# EAGLE design minibat (EAGLE 9.6.2)
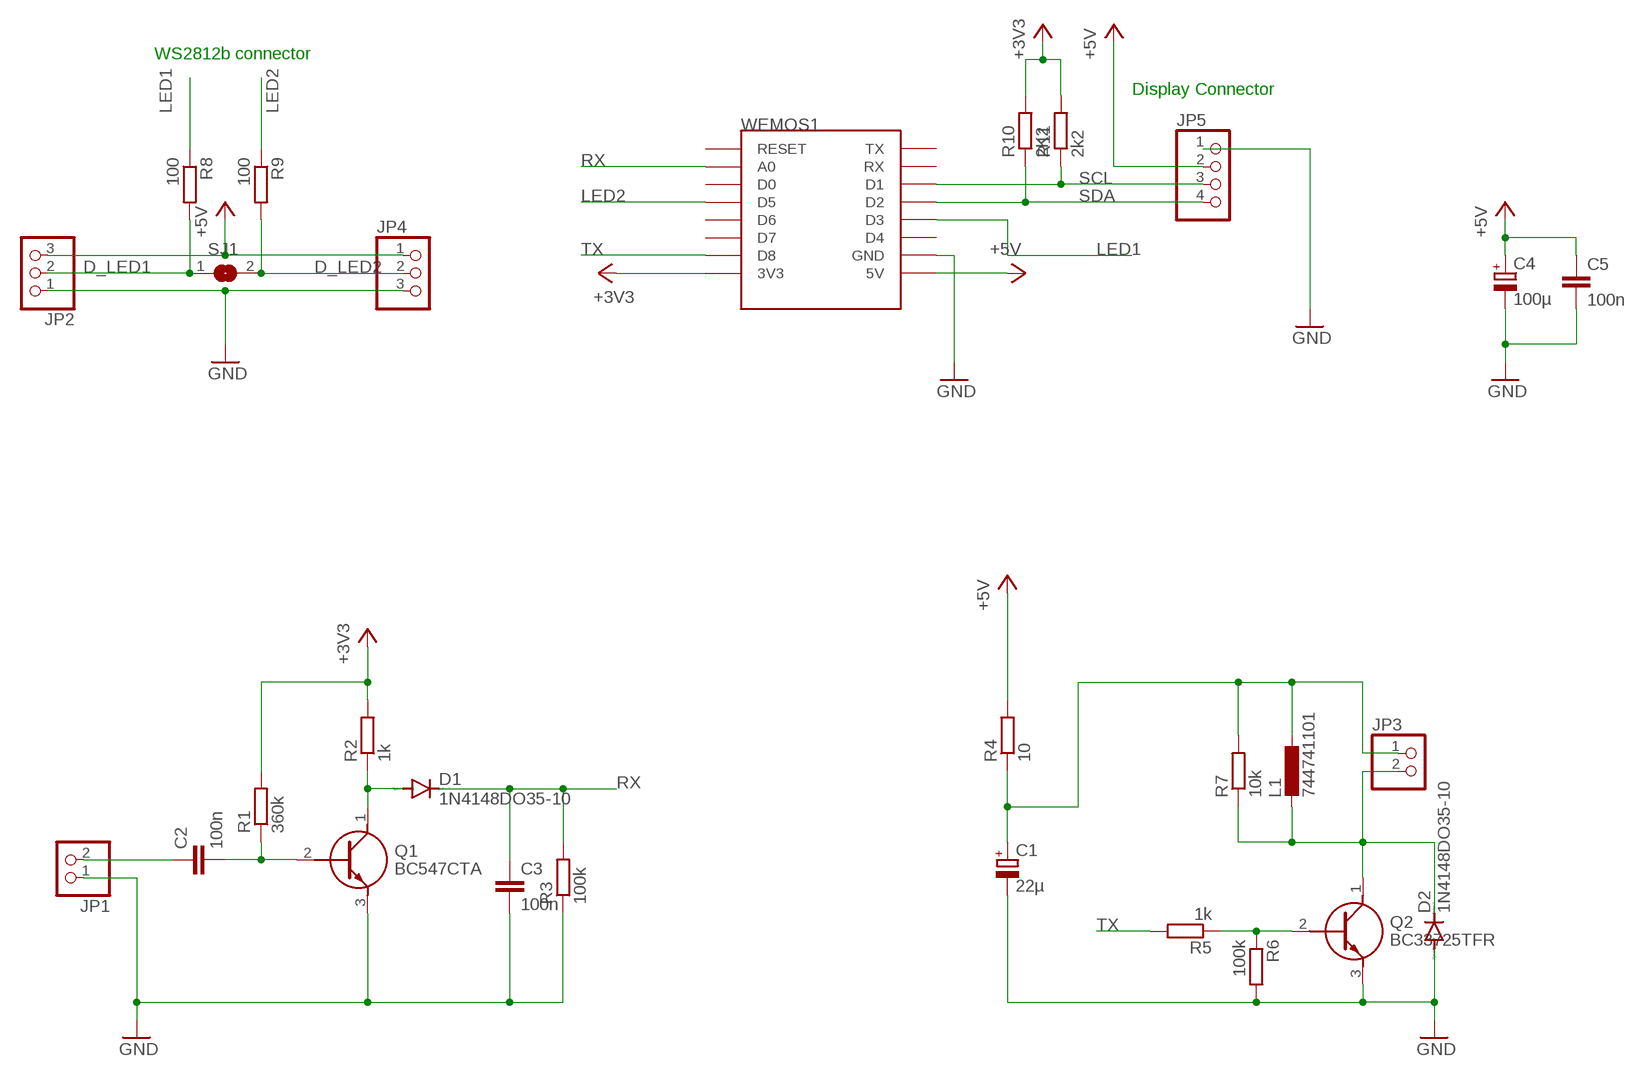
[diagram p0: schematic, sheet 1]

## Parts
C1  22µ  CPOL-EUE5-8.5  [E5-8,5]
C2  100n  C-EU050-035X075  [C050-035X075]
C3  100n  C-EU050-035X075  [C050-035X075]
C4  100µ  CPOL-EUE5-8.5  [E5-8,5]
C5  100n  C-EU050-035X075  [C050-035X075]
D1  1N4148DO35-10  [DO35-10]
D2  1N4148DO35-10  [DO35-10]
JP1  PINHD-1X2  [1X02]
JP2  PINHD-1X3  [1X03]
JP3  PINHD-1X2  [1X02]
JP4  PINHD-1X3  [1X03]
JP5  PINHD-1X4  [1X04]
L1  744741101  L-EU6000-XXX-RC  [6000-XXXX-RC]
Q1  BC547CTA  [MC79L15ACPG]
Q2  BC33725TFR  [BC33725TFR]
R1  360k  R-EU_0207/10  [0207/10]
R2  1k  R-EU_0207/10  [0207/10]
R3  100k  R-EU_0207/10  [0207/10]
R4  10  R-EU_0207/10  [0207/10]
R5  1k  R-EU_0207/10  [0207/10]
R6  100k  R-EU_0207/10  [0207/10]
R7  10k  R-EU_0207/10  [0207/10]
R8  100  R-EU_0207/10  [0207/10]
R9  100  R-EU_0207/10  [0207/10]
R10  2K2  R-EU_0207/10  [0207/10]
R11  2k2  R-EU_0207/10  [0207/10]
SJ1  SJ  [SJ]
WEMOS1  WEMOS-D1-MINI  [WEMOS-D1-MINI]

## Nets
+3V3: R1.2 R2.2 R10.2 R11.2 WEMOS1.3V3
+5V: C4.+ C5.1 JP2.3 JP4.1 JP5.2 R4.2 WEMOS1.5V
D_LED1: JP2.2 R8.2 SJ1.1
D_LED2: JP4.2 R9.2 SJ1.2
GND: C1.- C3.2 C4.- C5.2 D2.A JP1.1 JP2.1 JP4.3 JP5.1 Q1.3(E) Q2.3(E) R3.1 R6.2 WEMOS1.GND
LED1: R8.1 WEMOS1.D3
LED2: R9.1 WEMOS1.D5
N$1: C2.1 JP1.2
N$3: D1.A Q1.1(C) R2.1
N$4: C2.2 Q1.2(B) R1.1
N$5: C1.+ JP3.1 L1.1 R4.1 R7.2
N$7: D2.C JP3.2 L1.2 Q2.1(C) R7.1
N$9: Q2.2(B) R5.1 R6.1
RX: C3.1 D1.C R3.2 WEMOS1.A0
SCL: JP5.3 R11.1 WEMOS1.D1
SDA: JP5.4 R10.1 WEMOS1.D2
TX: R5.2 WEMOS1.D8
Unconnected: WEMOS1.D0 WEMOS1.D4 WEMOS1.D6 WEMOS1.D7 WEMOS1.RESET WEMOS1.RX WEMOS1.TX

## Notes on the sheet
- WS2812b connector
- Display Connector

## Library data of the parts
C1 C4 = rcl:CPOL-EU: POLARIZED CAPACITOR, European symbol; SPICEPREFIX: C
C2 C3 C5 = rcl:C-EU: CAPACITOR, European symbol; SPICEPREFIX: C
D1 D2 = diode:1N4148: DIODE high speed (Philips)
JP1 JP3 = pinhead:PINHD-1X2: PIN HEADER
JP2 JP4 = pinhead:PINHD-1X3: PIN HEADER
JP5 = pinhead:PINHD-1X4: PIN HEADER
L1 = rcl:L-EU: INDUCTOR, European symbol; SPICEPREFIX: L
Q1 = SamacSys_Parts:BC547CTA: Transistor GP NPN 45V 0.1A TO92 Source: Datasheet <http://www.onsemi.com/pub/Collateral/BC550-D.pdf>; DESCRIPTION: Transistor GP NPN 45V 0.1A TO92; HEIGHT: mm; MANUFACTURER_NAME: onsemi; MANUFACTURER_PART_NUMBER: BC547CTA; MOUSER_PART_NUMBER: 512-BC547CTA; MOUSER_PRICE-STOCK: https://www.mouser.co.uk/ProductDetail/ON-Semiconductor-Fairchild/BC547CTA?qs=UMEuL5FsraCrbXOwR03MUw%3D%3D
Q2 = SamacSys_Parts:BC33725TFR: ON Semi BC33725TFR NPN Transistor, 800 mA, 50 V, 3-Pin TO-92 100MHz Source: Datasheet <https://www.onsemi.com/pub/Collateral/BC338-D.pdf>; DESCRIPTION: ON Semi BC33725TFR NPN Transistor, 800 mA, 50 V, 3-Pin TO-92 100MHz; HEIGHT: 5.33mm; MANUFACTURER_NAME: onsemi; MANUFACTURER_PART_NUMBER: BC33725TFR; MOUSER_PART_NUMBER: 512-BC33725TFR; MOUSER_PRICE-STOCK: https://www.mouser.co.uk/ProductDetail/ON-Semiconductor-Fairchild/BC33725TFR?qs=zGXwibyAaHYlHlvhRz3mQw%3D%3D
R1-R11 = rcl:R-EU_: RESISTOR, European symbol; SPICEPREFIX: R
SJ1 = jumper:SJ: SMD solder JUMPER
WEMOS1 = esp8266modules:WEMOS-D1-MINI: WeMos.cc D1 mini ESP8266 module

## Board
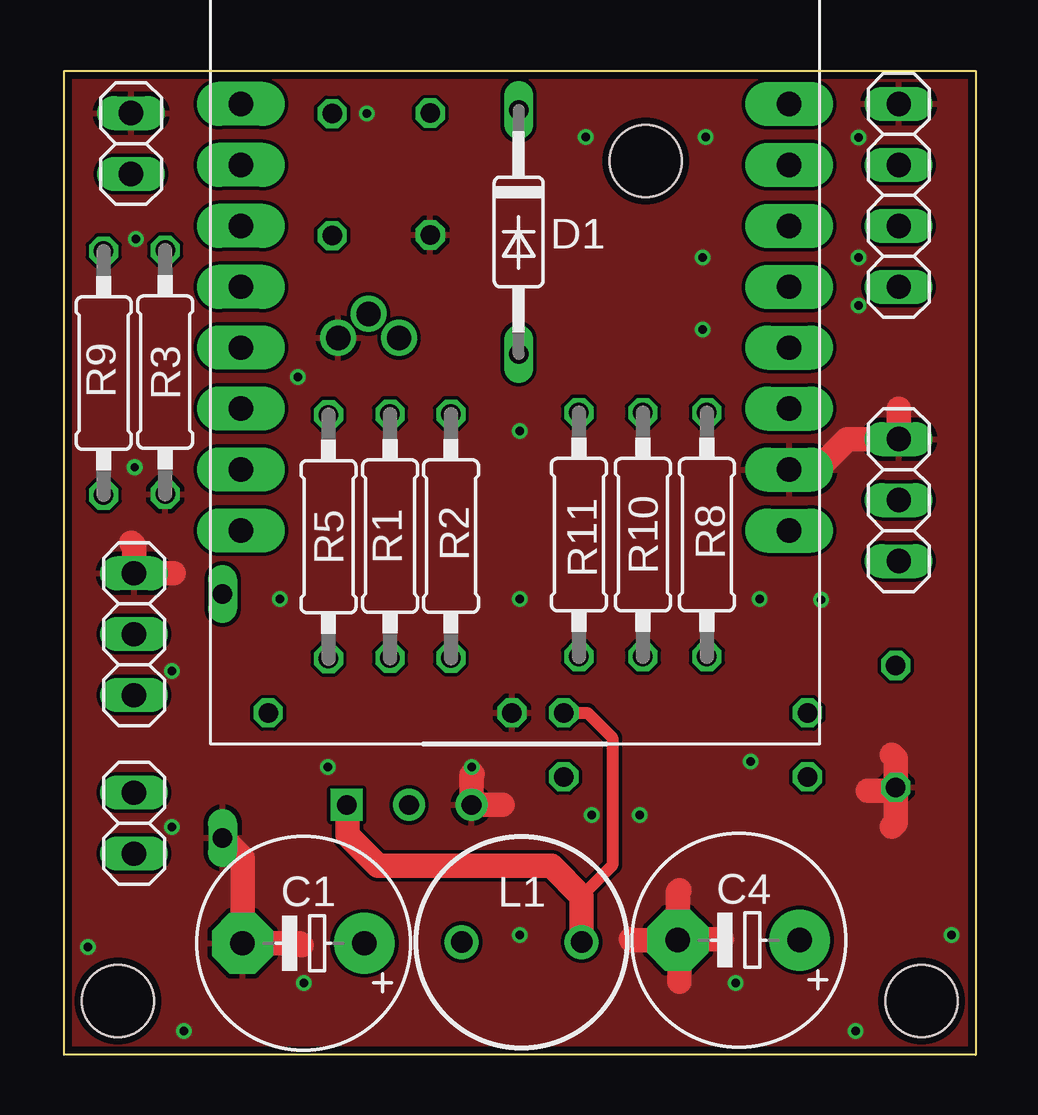
[diagram p1: board, top side]
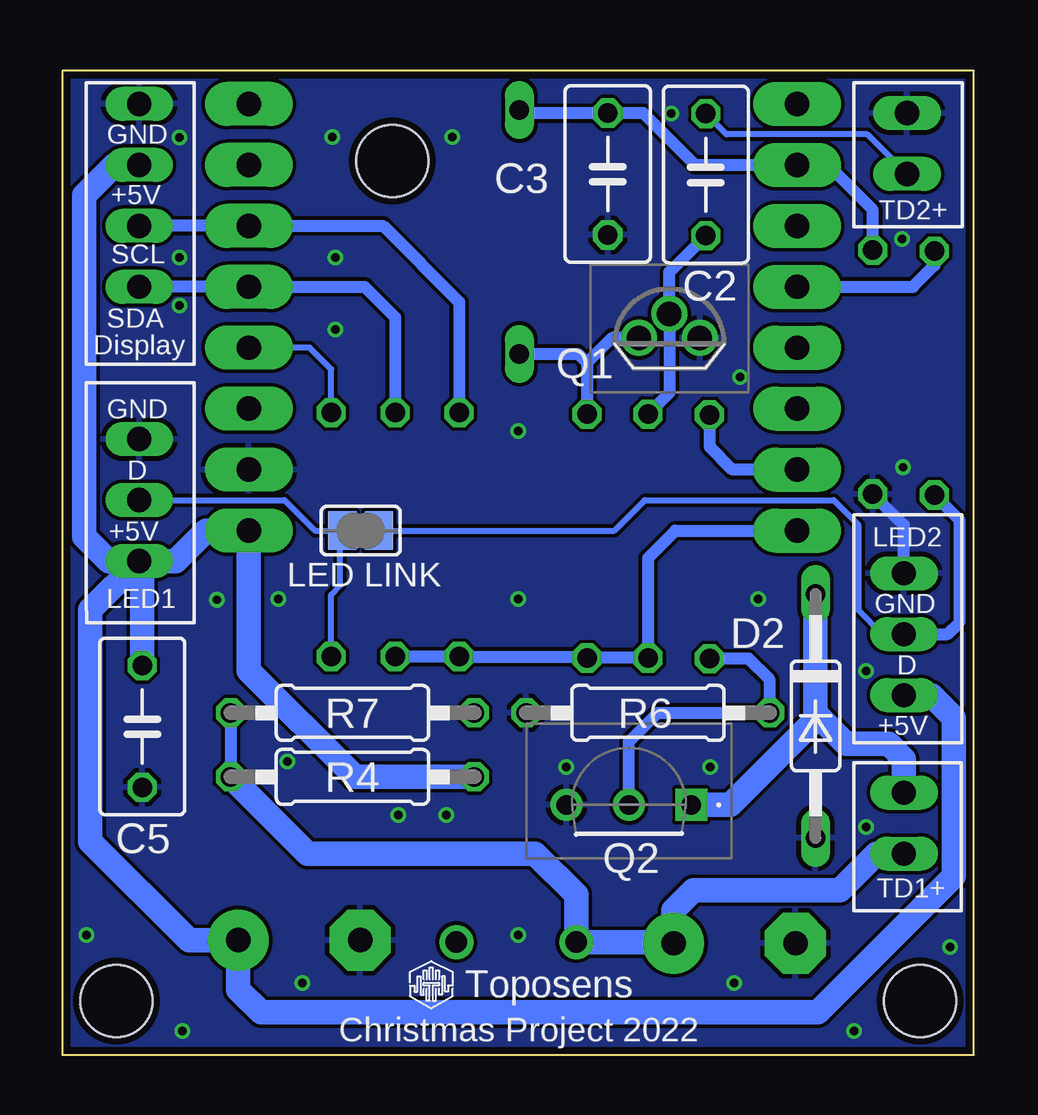
[diagram p2: board, bottom side, seen from below]

Size 38 x 41 mm. Coordinates in mm from the lower left corner, seen from the top.
Outline: 0,0 0,41 38,41 38,0 0,0
Copper layers (1*16): Top 0.035mm / dielectric 1.5mm / Bottom 0.035mm
Design rules "PCB-POOL Standard": minimum track width 0.15mm, minimum drill 0.3mm, track to track 0.15mm, track to pad 0.15mm, pad to pad 0.15mm, via to via 0.15mm, smd to smd 0.15mm, copper to edge 0.3mm, drill to drill 0.2mm, minimum pad ring 0.2mm, minimum via ring 0.15mm, stop-mask expansion 0.075mm, vias tented up to drill 0mil, thermal gap 0.2mm
Holes 3 mm at 24.25,37.25 2.25,2.25 35.75,2.25

### Footprints (pad centres in the part's own frame; a part is rotated, then mirrored left to right if it is on the bottom)
E5-8,5 = drill 1.016 pad 2.54: + -2.54,0 | drill 1.016 pad 2.54 octagon: - 2.54,0
C050-035X075 = drill 0.813 octagon: 1 -2.54,0; 2 2.54,0
DO35-10 = drill 0.813 long: A 5.08,0; C -5.08,0
1X02 = drill 1.016 long: 1 -1.27,0; 2 1.27,0
1X03 = drill 1.016 long: 1 -2.54,0; 2 0,0; 3 2.54,0
1X04 = drill 1.016 long: 1 -3.81,0; 2 -1.27,0; 3 1.27,0; 4 3.81,0
6000-XXXX-RC = drill 0.9 pad 1.422: 1 -2.5,0; 2 2.5,0
MC79L15ACPG = drill 1.01 pad 1.5: 1 0,0; 2 1.27,1; 3 2.54,0
BC33725TFR = drill 0.82 pad 1.333 square: 1 0,0 | drill 0.82 pad 1.333: 2 2.6,0; 3 5.2,0
0207/10 = drill 0.813 octagon: 1 -5.08,0; 2 5.08,0
SJ = smd 1.168 x 1.6: 1 -0.762,0; 2 0.762,0
WEMOS-D1-MINI = drill 1.016 pad 1.829 long: 3V3 -11.43,-7.62; 5V 11.43,-7.62; A0 -11.43,7.62; D0 -11.43,5.08; D1 11.43,5.08; D2 11.43,2.54; D3 11.43,0; D4 11.43,-2.54; D5 -11.43,2.54; D6 -11.43,0; D7 -11.43,-2.54; D8 -11.43,-5.08; GND 11.43,-5.08; RESET -11.43,10.16; RX 11.43,7.62; TX 11.43,10.16

### Placement (x,y rotation side)
C1  9.98,4.65 180 top
C2  11.18,36.68 270 bottom
C3  15.27,36.7 270 bottom
C4  28.12,4.79 180 top
C5  34.67,13.68 270 bottom
D1  18.95,34.29 270 top
D2  6.6,14.12 270 bottom
JP1  2.79,37.97 270 top
JP2  34.8,23.11 270 top
JP3  2.92,9.65 90 top
JP4  2.92,17.53 90 top
JP5  34.8,35.81 270 top
L1  19.08,4.7 0 top
Q1  13.97,29.87 0 bottom
Q2  11.79,10.41 180 bottom
R1  13.59,21.62 270 top
R2  16.13,21.62 270 top
R3  4.22,28.45 90 top
R4  25.91,11.58 0 bottom
R5  11.02,21.59 90 top
R6  13.59,14.25 180 bottom
R7  25.91,14.25 180 bottom
R8  26.8,21.68 270 top
R9  1.65,28.41 270 top
R10  24.13,21.68 270 top
R11  21.46,21.68 270 top
SJ1  25.57,21.84 0 bottom
WEMOS1  18.8,29.46 0 top

### Tracks (layer width: path | path; a pad name or v marks a point on that pad's centre or on a via)
+3V3
  Bottom 0.508: WEMOS1.3V3 12.45,21.84 13.59,20.7 R1.2 13.61,16.56 16.1,16.56 R2.2 16.18,16.59 21.35,16.59 21.4,16.54 R11.2 R10.2
+5V
  Bottom 1.016: JP2.3 33.27,20.57 32,21.84 WEMOS1.5V 30.23,16 25.81,11.58 R4.2 | JP2.3 36.83,18.54 36.83,8.89 32.73,4.79 C4.+ 30.66,2.72 29.72,1.78 6.5,1.78 0.85,7.44 0.85,14.05 1.78,14.99 JP4.1 | JP2.3 36.07,20.57 37.08,21.59 37.08,35.81 35.81,37.08 JP5.2 | C5.1 34.67,20.45 JP2.3
D_LED1
  Bottom 0.254: 26.67,21.84 27.47,21.84 28.74,23.11 JP2.2 | 26.67,21.84 SJ1.1 | R8.2 26.8,19.18 26.42,19.56 26.42,21.59 26.67,21.84
D_LED2
  Bottom 0.254: SJ1.2 14.99,21.84 13.72,23.11 5.84,23.11 4.83,22.1 4.83,18.54 3.81,17.53 JP4.2
  Bottom 0.508: JP4.2 1.1,17.53 0.59,18.03 0.59,22.27 R9.2
GND  (via drill 0.35)
  Top 1.016: C4.- 25.58,6.79 25.65,6.86 | C4.- 25.65,4.71 25.65,3.05 | C4.- 23.66,4.79 23.62,4.83 | C4.- 25.62,4.83 27.43,4.83 | 17.02,11.68 16.98,11.65 Q2.3 18.29,10.41 | 34.8,26.92 JP2.1 32.65,25.65 31.38,24.38 WEMOS1.GND | 2.79,21.34 2.92,21.21 JP4.3 4.57,20.07 | 9.91,4.57 9.82,4.65 C1.- 7.44,8.21 D2.A | C5.2 34.67,12.33 34.5,12.5 | C5.2 34.53,11 33.5,11 | C5.2 34.67,9.67 34.5,9.5
  Bottom 0.508: JP4.3 2.92,22.07 R3.1
  other vias: 1,4.5 5,1 33,1 37,5 10,3 19,5 28,3 17,12 11,12 4.5,9.5 4.5,16 3,34 12.62,39.22 33.12,33.22 26.62,33.22 26.62,30.22 33.12,31.22 33.12,38.22 28.62,12.22 19,18.99 19,25.99 9,18.99 29,18.99 31.56,18.96 2.95,24.49 9.75,28.24 21.75,38.24 26.75,38.24 24,10 22,10
  pour Bottom: -2,42 39.5,42 39.5,-1 -2,-1
  pour Top: -3,43 40.5,43 40.5,-2 -3,-2
LED1
  Bottom 0.254: R8.1 26.8,28.57 27.69,29.46 30.15,29.46 30.19,29.42
  Bottom 0.508: 30.19,29.42 WEMOS1.D3
LED2
  Bottom 0.508: WEMOS1.D5 2.54,32 1.65,32.89 R9.1
N$1
  Bottom 0.254: JP1.2 4.45,38.35 10.31,38.35 C2.1
N$3
  Bottom 0.508: Q1.1 15.09,29.87 16.13,28.83 | 16.13,28.83 R2.1 | D1.A 16.51,29.21 16.13,28.83
N$4
  Bottom 0.508: R1.1 12.7,27.59 Q1.2 12.7,32.61 C2.2
N$5
  Bottom 0.508: R7.2 R4.1
  Bottom 1.016: R4.1 27.79,8.38 18.29,8.38 16.58,6.67 L1.1 12.56,4.7 C1.+ 12.52,6.02 11.68,6.86 5.59,6.86 4.06,8.38 JP3.1
N$7
  Top 0.508: R7.1 21.82,14.25 22.86,13.21 22.86,7.9 21.58,6.62
  Top 1.016: L1.2 21.58,6.62 20.32,7.87 13.08,7.87 11.81,9.14 11.81,10.39 Q2.1
  Bottom 1.016: Q2.1 10.16,10.41 6.6,13.97 6.6,14.22 | JP3.2 2.92,12.32 3.56,12.95 5.33,12.95 6.6,14.22 | 6.6,14.22 D2.C
N$9
  Bottom 0.508: Q2.2 14.38,13.05 13.18,14.25 R6.1 8.51,15.62 9.4,16.51 R5.1
RX
  Bottom 0.508: R3.2 4.22,35.2 6.1,37.08 WEMOS1.A0 11.63,37.08 13.78,39.23 | 13.79,39.24 13.78,39.23 | D1.C 18.82,39.24 C3.1 15.25,39.23 13.78,39.23
SCL
  Bottom 0.508: JP5.3 WEMOS1.D1 24.64,34.54 21.46,31.37 R11.1
SDA
  Bottom 0.508: JP5.4 WEMOS1.D2 25.4,32 24.13,30.73 R10.1
TX
  Bottom 0.508: WEMOS1.D8 10.06,24.38 11.02,25.35 R5.2

### Text on the board
bPlace: GND | TD2+ | +5V | SCL | SDA | Display | GND | D | +5V | LED2 | LED LINK | LED1 | GND | D | +5V | TD1+ | Toposens | Christmas Project 2022
REF: GND | +5V | SCL | Display | Murata Transducer | SDA | GND | LED2 | DATA | WS2812b | +5V | GND | DATA | LED1 | WS2812b | +5V | Murata Transducer